# EAGLE schematic crystal-panel (EAGLE 5.07)
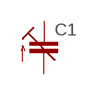
[diagram p0: schematic, sheet 1]

## Parts
C1  C-TRIMMCD-10  [CERMIT-DIE-10MM]
Unconnected: C1.P$1(A) C1.P$2(E)

## Library data of the parts
C1 = dtoy-RF:C-TRIMM: Trimm capacitor